# Altium schematic sheet I-O Connectors.SchDoc
size 431 x 279 mm; SheetNumber: 3; SheetTotal: 3
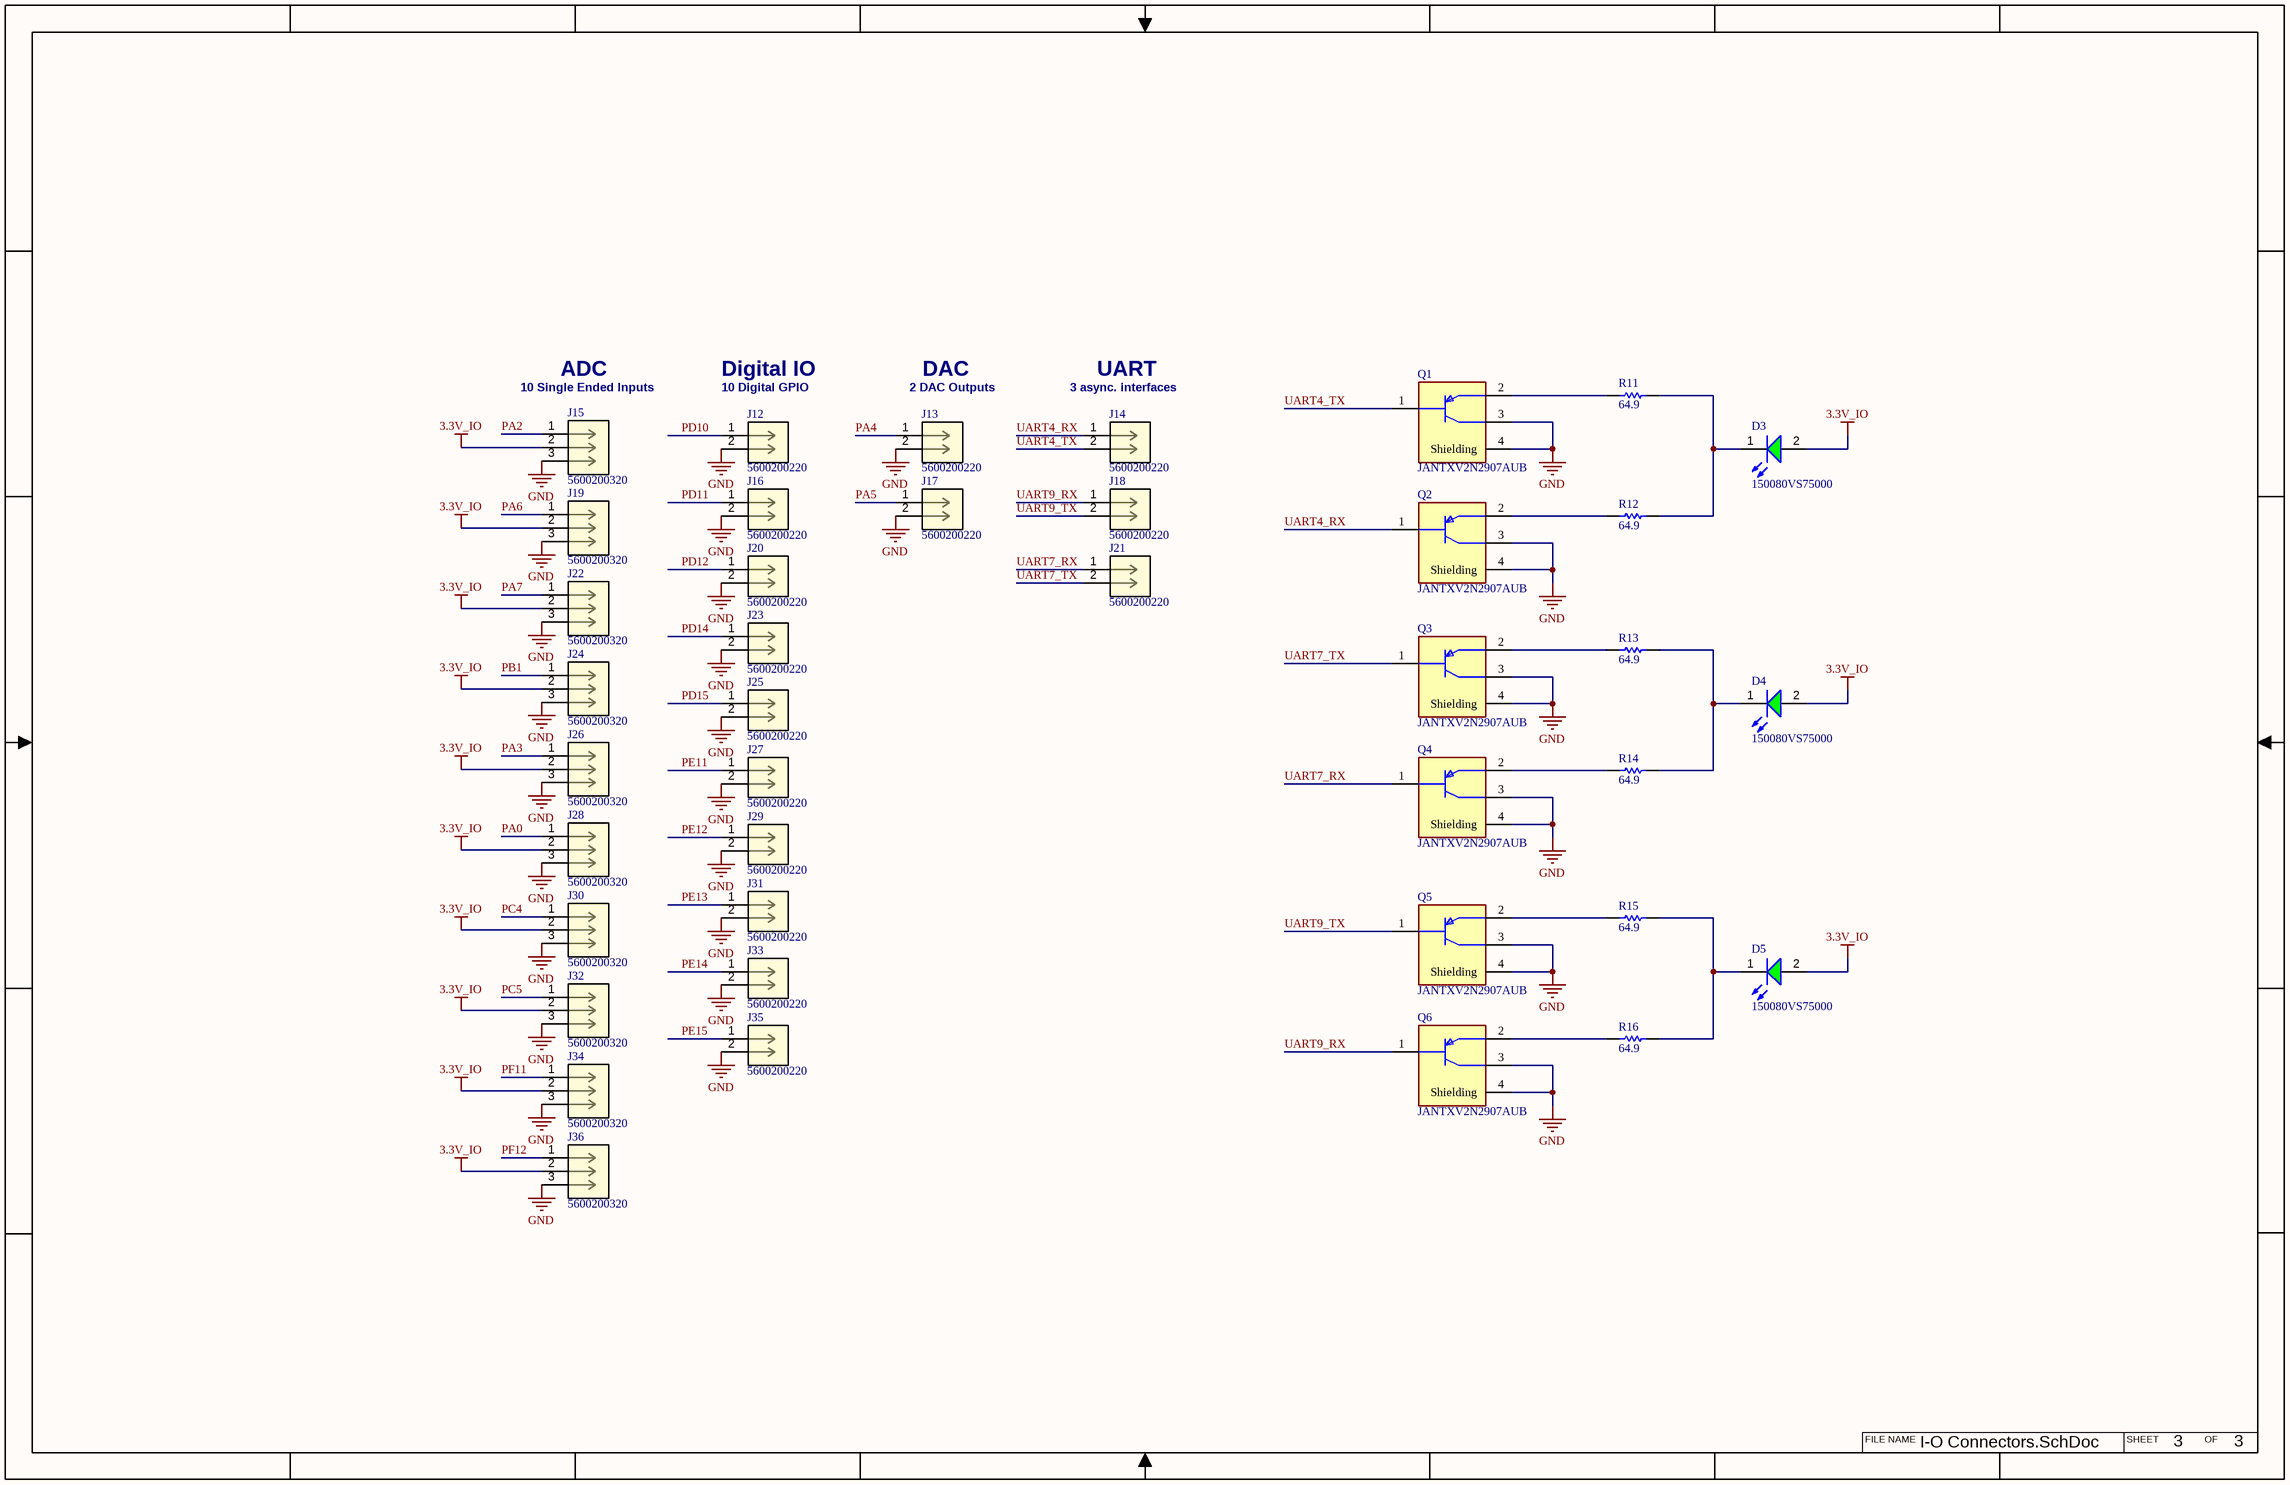
[diagram p0: I-O Connectors.SchDoc]

## Parts
D3  150080VS75000  [WL-SMCW_0805_150080xx75000]
D4  150080VS75000  [WL-SMCW_0805_150080xx75000]
D5  150080VS75000  [WL-SMCW_0805_150080xx75000]
J12  5600200220  [CONN_5600200220_MOL]
J13  5600200220  [CONN_5600200220_MOL]
J14  5600200220  [CONN_5600200220_MOL]
J15  5600200320  [CONN03_560020_MOL]
J16  5600200220  [CONN_5600200220_MOL]
J17  5600200220  [CONN_5600200220_MOL]
J18  5600200220  [CONN_5600200220_MOL]
J19  5600200320  [CONN03_560020_MOL]
J20  5600200220  [CONN_5600200220_MOL]
J21  5600200220  [CONN_5600200220_MOL]
J22  5600200320  [CONN03_560020_MOL]
J23  5600200220  [CONN_5600200220_MOL]
J24  5600200320  [CONN03_560020_MOL]
J25  5600200220  [CONN_5600200220_MOL]
J26  5600200320  [CONN03_560020_MOL]
J27  5600200220  [CONN_5600200220_MOL]
J28  5600200320  [CONN03_560020_MOL]
J29  5600200220  [CONN_5600200220_MOL]
J30  5600200320  [CONN03_560020_MOL]
J31  5600200220  [CONN_5600200220_MOL]
J32  5600200320  [CONN03_560020_MOL]
J33  5600200220  [CONN_5600200220_MOL]
J34  5600200320  [CONN03_560020_MOL]
J35  5600200220  [CONN_5600200220_MOL]
J36  5600200320  [CONN03_560020_MOL]
Q1  JANTXV2N2907AUB  [FP-UB-IPC_C]
Q2  JANTXV2N2907AUB  [FP-UB-IPC_C]
Q3  JANTXV2N2907AUB  [FP-UB-IPC_C]
Q4  JANTXV2N2907AUB  [FP-UB-IPC_C]
Q5  JANTXV2N2907AUB  [FP-UB-IPC_C]
Q6  JANTXV2N2907AUB  [FP-UB-IPC_C]
R11  64.9  [RESC2013X60X35LL10T20]
R12  64.9  [RESC2013X60X35LL10T20]
R13  64.9  [RESC2013X60X35LL10T20]
R14  64.9  [RESC2013X60X35LL10T20]
R15  64.9  [RESC2013X60X35LL10T20]
R16  64.9  [RESC2013X60X35LL10T20]

## Nets
3.3V_IO: D3.2(A) D4.2(A) D5.2(A) J15.2 J19.2 J22.2 J24.2 J26.2 J28.2 J30.2 J32.2 J34.2 J36.2
GND: J12.2 J13.2 J15.3 J16.2 J17.2 J19.3 J20.2 J22.3 J23.2 J24.3 J25.2 J26.3 J27.2 J28.3 J29.2 J30.3 J31.2 J32.3 J33.2 J34.3 J35.2 J36.3 Q1.3(C) Q1.4(Shielding) Q2.3(C) Q2.4(Shielding) Q3.3(C) Q3.4(Shielding) Q4.3(C) Q4.4(Shielding) Q5.3(C) Q5.4(Shielding) Q6.3(C) Q6.4(Shielding)
PA0: J28.1
PA2: J15.1
PA3: J26.1
PA4: J13.1
PA5: J17.1
PA6: J19.1
PA7: J22.1
PB1: J24.1
PC4: J30.1
PC5: J32.1
PD10: J12.1
PD11: J16.1
PD12: J20.1
PD14: J23.1
PD15: J25.1
PE11: J27.1
PE12: J29.1
PE13: J31.1
PE14: J33.1
PE15: J35.1
PF11: J34.1
PF12: J36.1
UART4_RX: J14.1 Q2.1(B)
UART4_TX: J14.2 Q1.1(B)
UART7_RX: J21.1 Q4.1(B)
UART7_TX: J21.2 Q3.1(B)
UART9_RX: J18.1 Q6.1(B)
UART9_TX: J18.2 Q5.1(B)
NetD3_1: D3.1(K) R11.1 R12.1
NetD4_1: D4.1(K) R13.1 R14.1
NetD5_1: D5.1(K) R15.1 R16.1
NetQ1_2: Q1.2(E) R11.2
NetQ2_2: Q2.2(E) R12.2
NetQ3_2: Q3.2(E) R13.2
NetQ4_2: Q4.2(E) R14.2
NetQ5_2: Q5.2(E) R15.2
NetQ6_2: Q6.2(E) R16.2

## Notes on the sheet
- (near J15) 10 Single Ended Inputs
- (near J15) ADC
- Digital IO
- (near J12) 10 Digital GPIO
- (near J13) 2 DAC Outputs
- DAC
- (near J14) 3 async. interfaces
- UART
- I-O Connectors.SchDoc
- 3
- FILE NAME
- SHEET
- OF

## Library data of the parts
D3-D5 = CMP-1426-00009-6: WL-SMCW SMT Mono-Color Chip LED Waterclear; Max Junction Temperature (Tj): 95°C; Max Reverse Voltage (DC): 5V; Luminous Intensity: 40mcd; Color: Green; Peak Wavelength: 572nm; Wavelength: 570nm; Viewing Angle: 140°; Power Dissipation: 72mW; Forward Current: 100mA; Test Current: 20mA; Forward Voltage: 2V; Lens Style: Clear, Rectangular; Reverse Voltage: 5V; Length: 2mm; RoHS: Compliant; Min Operating Temperature: -40°C; REACH SVHC: Unknown; Packaging: Tape and Reel; Case/Package: 0805; Max Operating Temperature: 85°C; Case Code (Metric): 2012; Width: 1.25mm; Dominant Wavelength: 570nm; Mount: Surface Mount; Case Code (Imperial): 0805; Height: 700µm
J12-J14 J16-J18 J20 J21 J23 J25 J27 J29 J31 J33 J35 = 5600200220: No Description Available; Mfr_Name: Molex Connector Corporation; RefDes: RefDes; Type: Type
J15 J19 J22 J24 J26 J28 J30 J32 J34 J36 = 5600200320: No Description Available; Mfr_Name: Molex Connector Corporation; RefDes: RefDes; Type: Type
Q1-Q6 = CMP-06366-000007-1: TRANS PNP 60V 0.6A 4UB
R11-R16 = CMP-2001-01223-1: Part Number: RC0805FR-0764R9L; Manufacturer: Yageo